# Altium schematic sheet eVPS_Top Level.SchDoc: eVPS_Top Level
size A4; DrawnBy: Ivica Matovic; Revision: v1.1; SheetNumber: 2; SheetTotal: 3
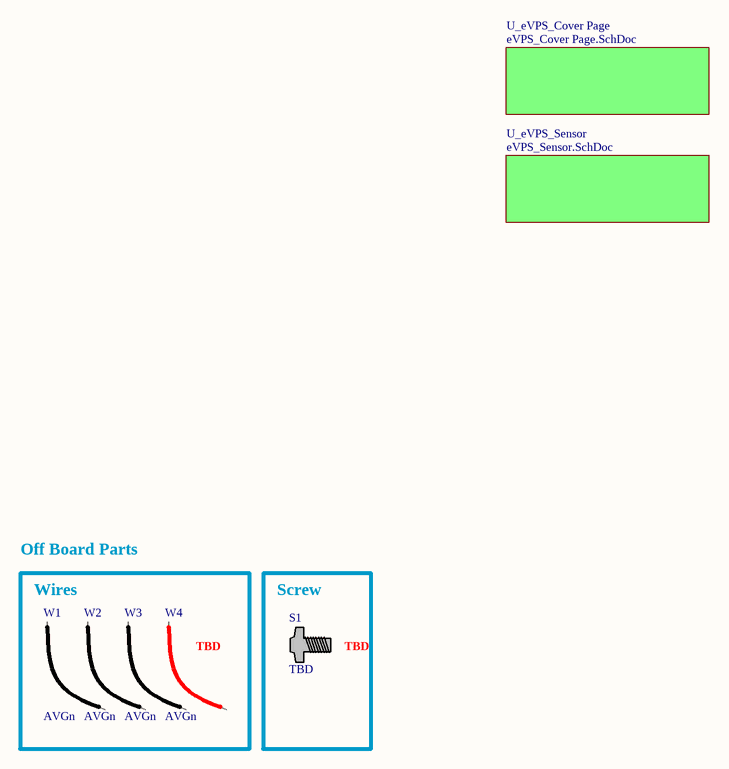
[diagram p0: eVPS_Top Level.SchDoc]

## Parts
S1  TBD  (mechanical)
W1  AVGn  (mechanical)
W2  AVGn  (mechanical)
W3  AVGn  (mechanical)
W4  AVGn  (mechanical)

## Blocks framed on the sheet
Screw: S1

## Sub-sheets
U_eVPS_Cover Page = eVPS_Cover Page.SchDoc: no entries
U_eVPS_Sensor = eVPS_Sensor.SchDoc: no entries

## Notes on the sheet
- Off Board Parts
- Wires
- (near W4) TBD
- TBD
- Title:
- Bitgear
- Size:
- Date:
- Drawn By:
- A
- Doc. No:
- Time:
- Checked By:
- Sheet
- Rev:
- of
- Stevana Markovica 8
- 11080 Belgrade
- Serbia
- www.bitgear.rs
- Approved By:
- File:

## Library data of the parts
S1 = Screw XY: Value: TBD
W1-W3 = Wire Black: AVG TBD [Length]; Value: AVGn
W4 = Wire Red: AVG TBD [Length]; Value: AVGn